# EAGLE design FT2328Breakout (EAGLE 9.6.2)
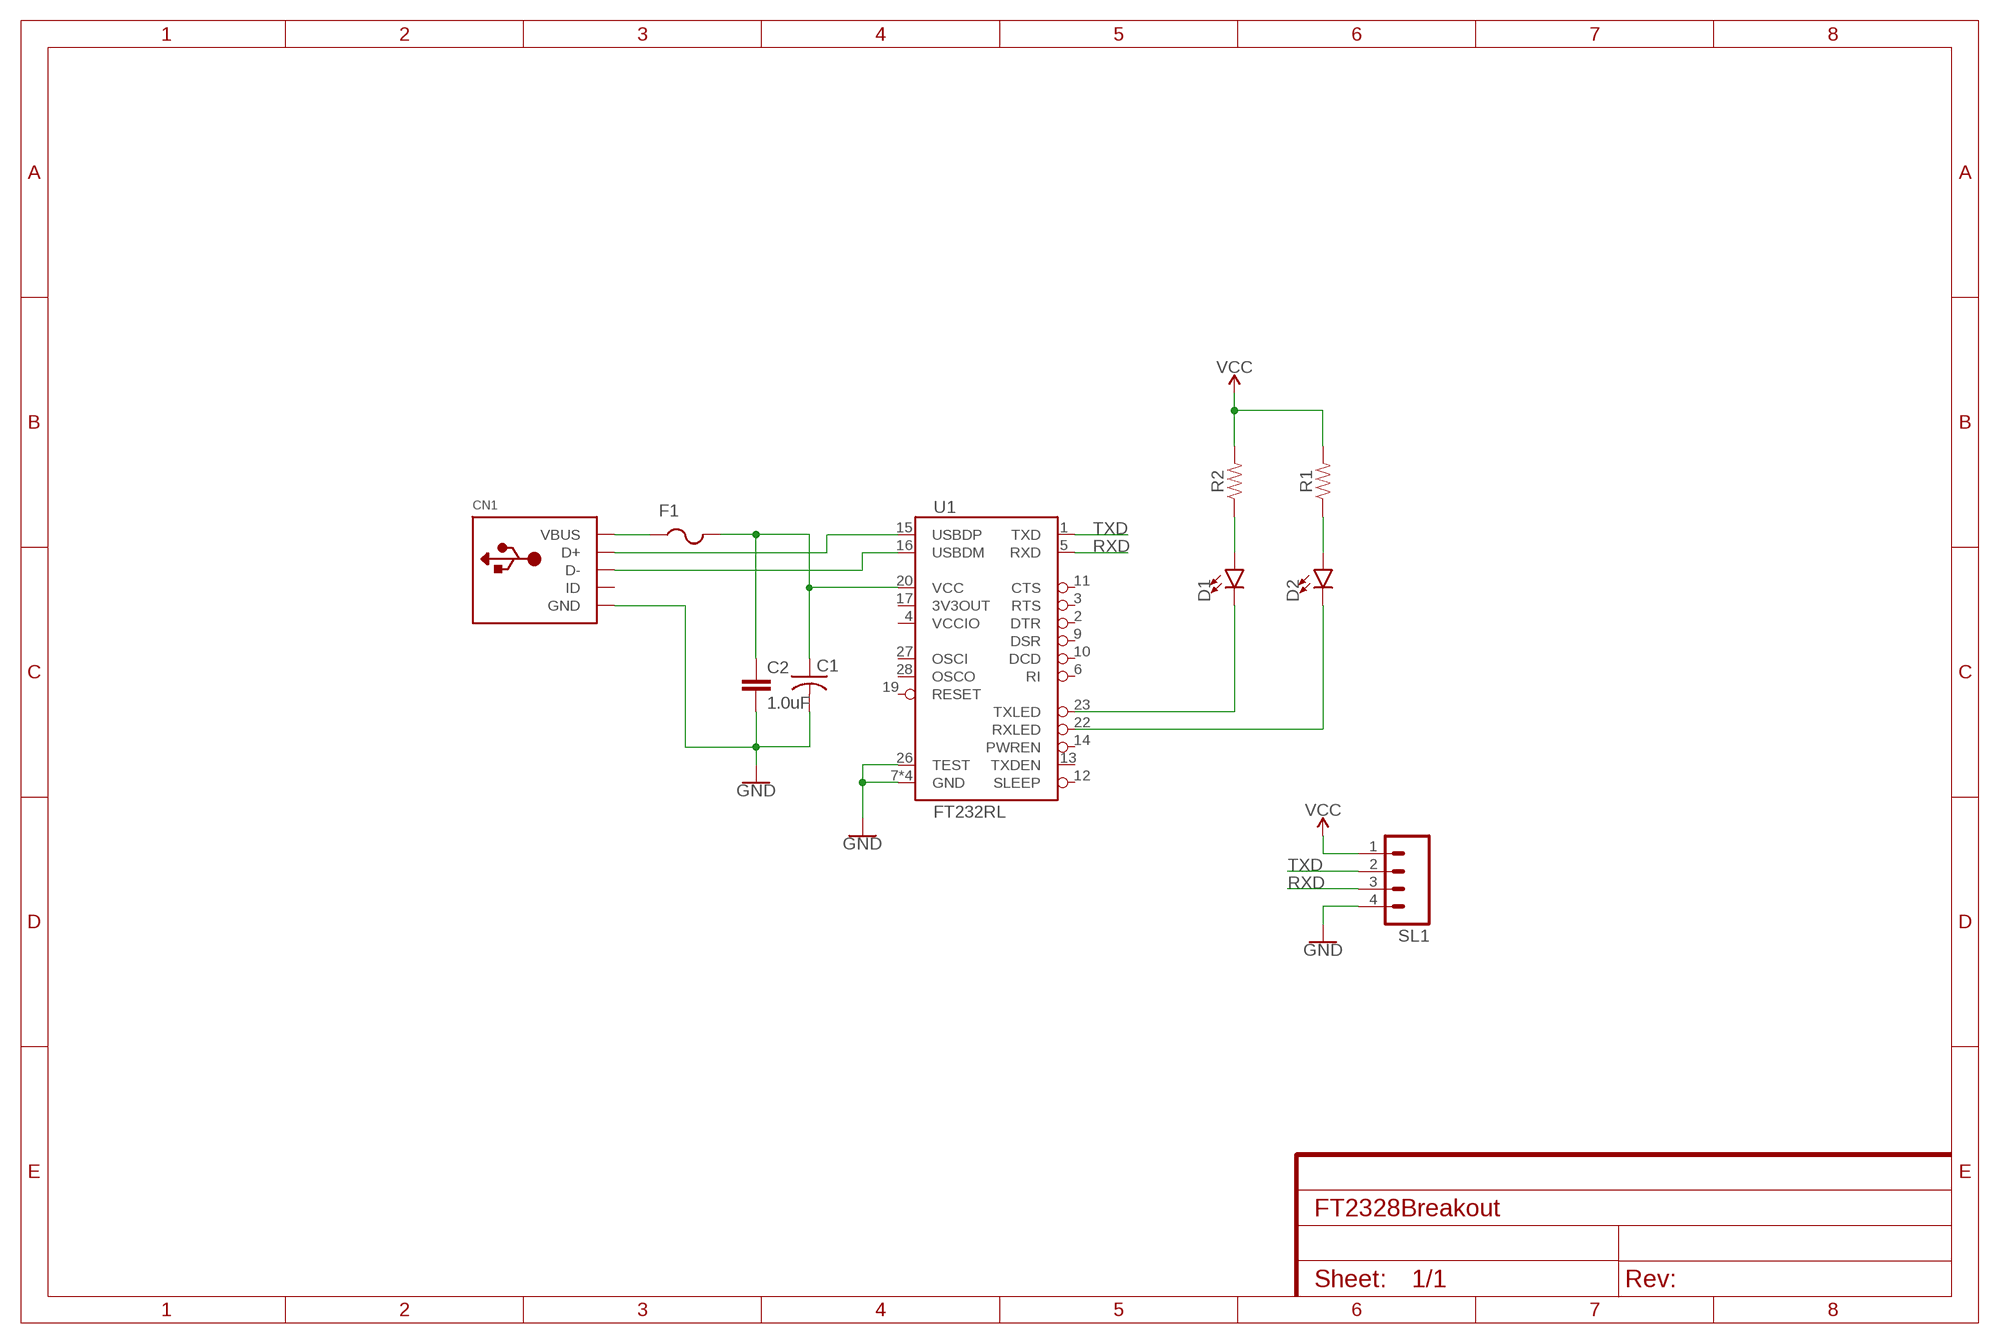
[diagram p0: schematic, sheet 1]

## Parts
C1  C-USC1206  [C1206]
C2  1.0uF  1.0UF-1206-50V-10%  [1206]
CN1  USBMINIB  [USB-MINIB]
D1  LED1206  [LED-1206]
D2  LED1206  [LED-1206]
F1  PTCFUSE-1206  [R1206]
R1  RESISTOR1206  [1206]
R2  RESISTOR1206  [1206]
SL1  M04  [04P]
U1  FT232RL  FT232RLSSOP  [SSOP28DB]

## Nets
GND: C1.2 C2.2 CN1.GND SL1.4 U1.7(GND) U1.18(GND) U1.21(GND) U1.25(GND) U1.26(TEST)
N$1: CN1.VBUS F1.1
N$2: C1.1 C2.1 F1.2 U1.20(VCC)
N$3: D1.A R2.1
N$4: CN1.D- U1.16(USBDM)
N$5: CN1.D+ U1.15(USBDP)
N$6: D2.A R1.1
N$7: D1.C U1.23(TXLED)
N$8: D2.C U1.22(RXLED)
RXD: SL1.3 U1.5(RXD)
TXD: SL1.2 U1.1(TXD)
VCC: R1.2 R2.2 SL1.1
Unconnected: CN1.ID U1.2(DTR) U1.3(RTS) U1.6(RI) U1.9(DSR) U1.10(DCD) U1.11(CTS) U1.12(SLEEP) U1.13(TXDEN) U1.14(PWREN) U1.17(3V3OUT) U1.19(RESET) U1.27(OSCI) U1.28(OSCO)

## Power pins joined to a net without a drawn wire
VCCIO: U1.4(VCCIO)

## Library data of the parts
C1 = adafruit:C-US: CAPACITOR, American symbol
C2 = SparkFun-Capacitors:1.0UF: 1µF ceramic capacitors A capacitor is a passive two-terminal electrical component used to store electrical energy temporarily in an electric field.; PROD_ID: CAP-09822
CN1 = adafruit:USB: USB Connectors USBMINIB - Surface Mount Female Mini-B USB Connector 4UConnector: 06564 By microbuilder.eu Thru-hole RA Female Mini-B USB Connector 4UConnector: 18732 By ladyada.net
D1 D2 = SparkFun-LED:LED: LED (Generic) Standard schematic elements and footprints for 5mm, 3mm, 1206, and 0603 sized LEDs. Generic LEDs with no color specified.
F1 = adafruit:PTCFUSE: PTC fuses, resettable thermistors
R1 R2 = SparkFun-Resistors:RESISTOR: Generic Resistor Package
SL1 = con-amp-quick:M04: AMP QUICK CONNECTOR; OC_FARNELL: unknown; OC_NEWARK: unknown
U1 = SparkFun-IC-Comms:FT232RL: FT232RL USB UART FT232RL 4th Generation USB UART (USB <-> Serial) Controller. Datasheet <http://www.sparkfun.com/datasheets/IC/FT232R_v104.pdf> SparkFun Products Component <https://www.sparkfun.com/products/650> (COM-00650) SparkFun RedBot Mainboard <https://www.sparkfun.com/products/12097> (ROB-12097) SparkFun FTDI Basic Breakout - 5V <https://www.sparkfun.com/products/9716> (DEV-09716) SparkFun FTDI Basic Breakout - 3.3V <https://www.sparkfun.com/products/9873> (DEV-09873) Bus Pirate - v3.6a <https://www.sparkfun.com/products/12942> (TOL-12942) SparkFun USB to Serial Breakout - FT232RL <https://www.sparkfun.com/products/12731> (BOB-12731) SparkFun PicoBoard <https://www.sparkfun.com/products/11888> (WIG-11888) SparkFun RFID USB Reader <https://www.sparkfun.com/products/9963> (SEN-09963) LilyPad FTDI Basic Breakout - 5V <https://www.sparkfun.com/products/10275> (DEV-10275) SparkFun Stepoko <https://www.sparkfun.com/products/13899> (ROB-13899); PROD_ID: IC-00870

## Board
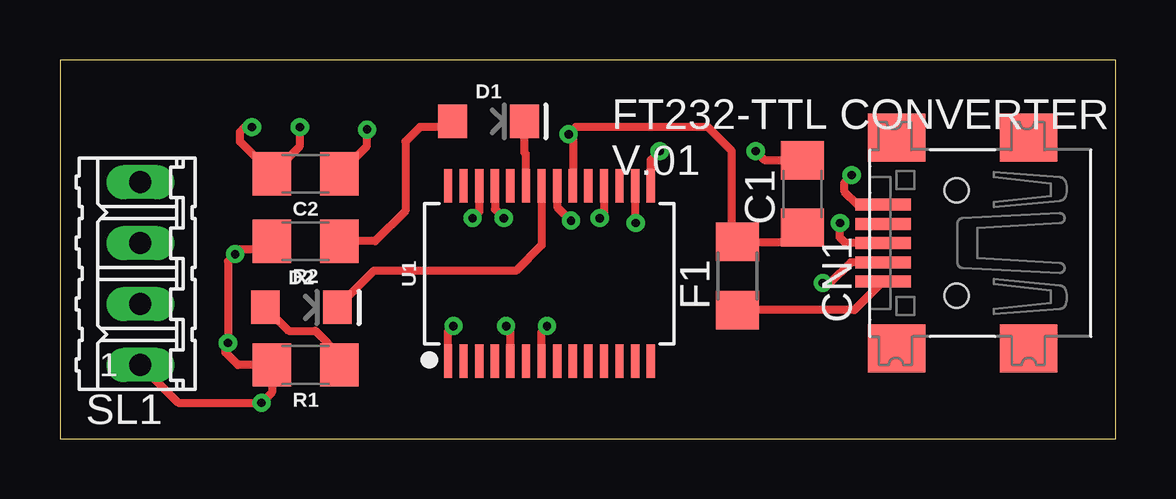
[diagram p1: board, top side]
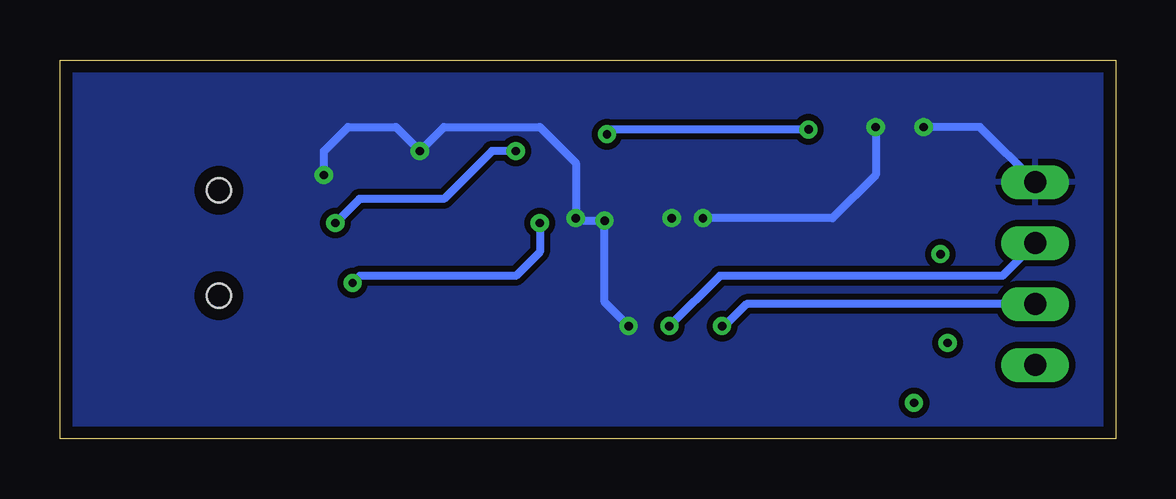
[diagram p2: board, bottom side, seen from below]

Size 44 x 15.8 mm. Coordinates in mm from the lower left corner, seen from the top.
Outline: 0,0 44,0 44,15.8 0,15.8 0,0
Copper layers (1*16): Top 0.035mm / dielectric 1.5mm / Bottom 0.035mm
Design rules "default *": minimum track width 6mil, minimum drill 0.35mm, track to track 10mil, track to pad 10mil, pad to pad 10mil, via to via 10mil, smd to smd 10mil, copper to edge 20mil, drill to drill 6mil, minimum pad ring 10mil, minimum via ring 8mil, stop-mask expansion 4mil, vias tented up to drill 0mil, thermal gap 10mil

### Footprints (pad centres in the part's own frame; a part is rotated, then mirrored left to right if it is on the bottom)
C1206 = smd 1.6 x 1.8: 1 -1.4,0; 2 1.4,0
1206 = smd 1.6 x 1.8: 1 -1.4,0; 2 1.4,0
USB-MINIB = smd 0.5 x 2.308: D+ 0,4.064; D- -0.8,4.064; GND 1.6,4.064; ID 0.8,4.064; VBUS -1.6,4.064 | smd 2 x 2.4: GND1 -4.4,-2; GND2 -4.4,3.5; GND3 4.4,3.5; GND4 4.4,-2 | hole 1: -2.2,1; 2.2,1
LED-1206 = smd 1.2 x 1.4: A -1.5,0; C 1.5,0
R1206 = smd 1.6 x 1.803: 1 -1.422,0; 2 1.422,0
04P = drill 0.914 long: 1 -3.81,0; 2 -1.27,0; 3 1.27,0; 4 3.81,0
SSOP28DB = smd 0.348 x 1.397: 1 -4.225,-3.656; 2 -3.575,-3.656; 3 -2.925,-3.656; 4 -2.275,-3.656; 5 -1.625,-3.656; 6 -0.975,-3.656; 7 -0.325,-3.656; 8 0.325,-3.656; 9 0.975,-3.656; 10 1.625,-3.656; 11 2.275,-3.656; 12 2.925,-3.656; 13 3.575,-3.656; 14 4.225,-3.656; 15 4.225,3.656; 16 3.575,3.656; 17 2.925,3.656; 18 2.275,3.656; 19 1.625,3.656; 20 0.975,3.656; 21 0.325,3.656; 22 -0.325,3.656; 23 -0.975,3.656; 24 -1.625,3.656; 25 -2.275,3.656; 26 -2.925,3.656; 27 -3.575,3.656; 28 -4.225,3.656

### Placement (x,y rotation side)
C1  30.95,10.21 90 top
C2  10.24,11.05 180 top
CN1  38.37,8.16 90 top
D1  17.86,13.24 0 top
D2  10.06,5.48 0 top
F1  28.24,6.79 90 top
R1  10.24,3.08 180 top
R2  10.24,8.24 180 top
SL1  3.35,6.89 90 top
U1  20.4,6.89 0 top

### Tracks (layer width: path | path; a pad name or v marks a point on that pad's centre or on a via)
GND  (via drill 0.35)
  Top 0.33: U1.26 17.48,9.47 v17.2,9.2 | U1.25 18.12,9.57 v18.5,9.2 | U1.21 20.73,9.68 v21.3,9.1 | U1.18 22.68,9.38 v22.5,9.2 | U1.7 20.07,4.47 v20.3,4.7 | v8,13 7.7,13 7.5,12.8 7.5,12.39 C2.2 10,12.21 v10,13 | C1.2 29.39,11.61 v29,12 | CN1.GND 33.24,9.76 32.7,10.3 32.7,10.7 v33,11
  Bottom 0.33: SL1.4 5.65,13 v8,13 | v10,13 10,11 11.8,9.2 v17.2,9.2 | v20.3,4.7 21.3,5.7 v21.3,9.1 22.4,9.1 v22.5,9.2 22.5,11.5 24,13 28,13 v29,12 30,13 32,13 33,12 v33,11
  pour Bottom: 44,0 0,0 0,15.8 44,15.8
N$1
  Top 0.33: CN1.VBUS 33.11,5.37 F1.1
N$2  (via drill 0.35)
  Top 0.33: C1.1 30.35,8.21 F1.2 28,8.45 28,12 27,13 21.5,13 v21.2,12.7 21.38,12.53 U1.20 | C2.1 12.8,12.21 v12.8,12.9
  Bottom 0.33: v12.8,12.9 21,12.9 v21.2,12.7
N$3
  Top 0.33: D1.A 16.12,13 15,13 14.4,12.4 14.4,9.5 13.14,8.24 R2.1
N$4  (via drill 0.35)
  Top 0.33: CN1.D- 32.96,7.36 32.1,6.5 v31.8,6.5 | U1.16 23.98,9.22 24,9.2 v24,9
  Bottom 0.33: v24,9 24,7.8 25,6.8 31.5,6.8 v31.8,6.5
N$5  (via drill 0.35)
  Top 0.33: CN1.D+ 32.74,8.16 32.5,8.4 32.5,8.98 v32.52,9 | U1.15 24.62,11.62 v25,12
  Bottom 0.33: v25,12 26,12 28,10 31.52,10 v32.52,9
N$6
  Top 0.33: D2.A 9.54,4.5 10.65,4.5 11.64,3.51 R1.1
N$7
  Top 0.33: U1.23 19.43,11.88 19.36,11.94 D1.C
N$8
  Top 0.33: D2.C 13.08,7 19,7 20.07,8.07 U1.22
RXD  (via drill 0.35)
  Top 0.33: U1.5 18.77,4.53 v18.6,4.7
  Bottom 0.33: SL1.3 4.71,6.8 16.5,6.8 v18.6,4.7
TXD  (via drill 0.35)
  Top 0.33: U1.1 16.18,4.47 v16.4,4.7
  Bottom 0.33: SL1.2 15.38,5.62 16.3,4.7 v16.4,4.7
VCC  (via drill 0.35)
  Top 0.33: R2.2 8.5,7.9 7.5,7.9 v7.3,7.7 7,7.4 v7,4 6.9,3.9 6.9,3.6 7.42,3.08 R1.2 8.84,1.94 v8.4,1.5 4.93,1.5 SL1.1

### Text on the board
tPlace: FT232-TTL CONVERTER / V.01